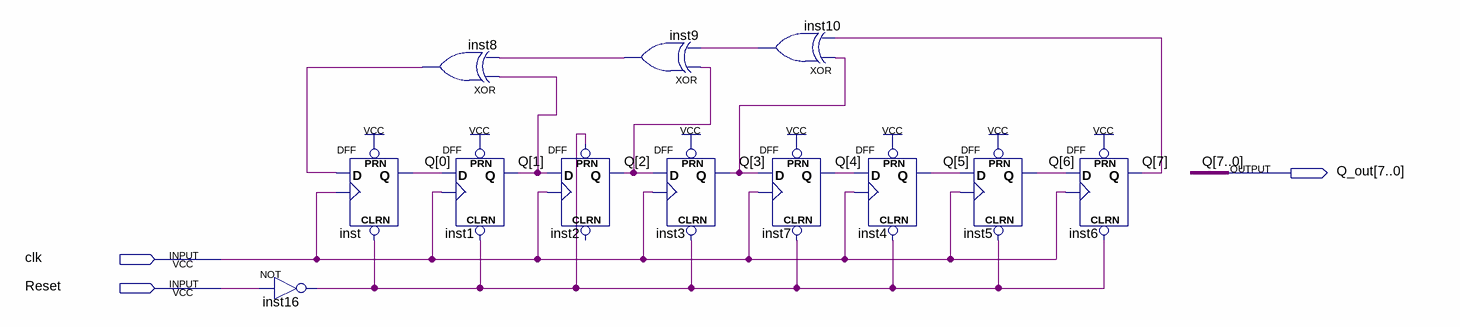
[diagram p0: schematic sheet]
// Quartus schematic LFSR.bdf as structural Verilog: 12 symbols, 3 pins
module LFSR (
  input  clk,
  input  Reset,
  output [7:0] Q_out
);

  wire inst8_out, inst9_out, inst10_out, inst16_out;

  not inst16 (inst16_out, Reset);
  DFF inst (.CLRN(inst16_out), .CLK(clk), .D(inst8_out), .PRN(1'b1), .Q(Q_out[0]));
  xor inst8 (inst8_out, Q_out[1], inst9_out);
  DFF inst1 (.CLRN(inst16_out), .CLK(clk), .D(Q_out[0]), .PRN(1'b1), .Q(Q_out[1]));
  DFF inst2 (.CLK(clk), .D(Q_out[1]), .PRN(inst16_out), .Q(Q_out[2]));  // open: CLRN
  xor inst9 (inst9_out, Q_out[2], inst10_out);
  DFF inst3 (.CLRN(inst16_out), .CLK(clk), .D(Q_out[2]), .PRN(1'b1), .Q(Q_out[3]));
  xor inst10 (inst10_out, Q_out[3], Q_out[7]);
  DFF inst7 (.CLRN(inst16_out), .CLK(clk), .D(Q_out[3]), .PRN(1'b1), .Q(Q_out[4]));
  DFF inst4 (.CLRN(inst16_out), .CLK(clk), .D(Q_out[4]), .PRN(1'b1), .Q(Q_out[5]));
  DFF inst5 (.CLRN(inst16_out), .CLK(clk), .D(Q_out[5]), .PRN(1'b1), .Q(Q_out[6]));
  DFF inst6 (.CLRN(inst16_out), .CLK(clk), .D(Q_out[6]), .PRN(1'b1), .Q(Q_out[7]));

  // Other names for the same wires on the sheet: Q[7:0] = Q_out
endmodule
